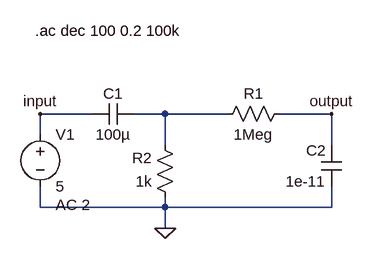
[diagram p0: schematic band_pass_schematic.asc]
band_pass_schematic.asc, the LTspice schematic file:
Version 4
SHEET 1 880 680
WIRE -128 112 -208 112
WIRE -16 112 -64 112
WIRE 80 112 -16 112
WIRE 240 112 160 112
WIRE -208 144 -208 112
WIRE -16 160 -16 112
WIRE 240 160 240 112
WIRE -208 256 -208 224
WIRE -16 256 -16 240
WIRE -16 256 -208 256
WIRE 240 256 240 224
WIRE 240 256 -16 256
WIRE -16 288 -16 256
FLAG -16 288 0
FLAG 240 112 output
FLAG -208 112 input
SYMBOL res 176 96 R90
WINDOW 0 0 56 VBottom 2
WINDOW 3 32 56 VTop 2
SYMATTR InstName R1
SYMATTR Value 1Meg
SYMBOL res 0 256 R180
WINDOW 0 36 76 Left 2
WINDOW 3 36 40 Left 2
SYMATTR InstName R2
SYMATTR Value 1k
SYMBOL cap -64 96 R90
WINDOW 0 0 32 VBottom 2
WINDOW 3 32 32 VTop 2
SYMATTR InstName C1
SYMATTR Value 100µ
SYMBOL cap 256 224 R180
WINDOW 0 24 56 Left 2
WINDOW 3 24 8 Left 2
SYMATTR InstName C2
SYMATTR Value 1e-11
SYMBOL voltage -208 128 R0
WINDOW 123 24 124 Left 2
WINDOW 39 0 0 Left 0
SYMATTR Value2 AC 2
SYMATTR InstName V1
SYMATTR Value 5
TEXT -216 -16 Left 2 !.ac dec 100 0.2 100k

The netlist it stands for:
* band_pass_schematic.asc
R1 output N001 1Meg
R2 0 N001 1k
C1 N001 input 100µ
C2 0 output 1e-11
V1 input 0 5 AC 2
.ac dec 100 0.2 100k
.backanno
.end